# EAGLE design BUS_TEST (EAGLE 9.6.2)
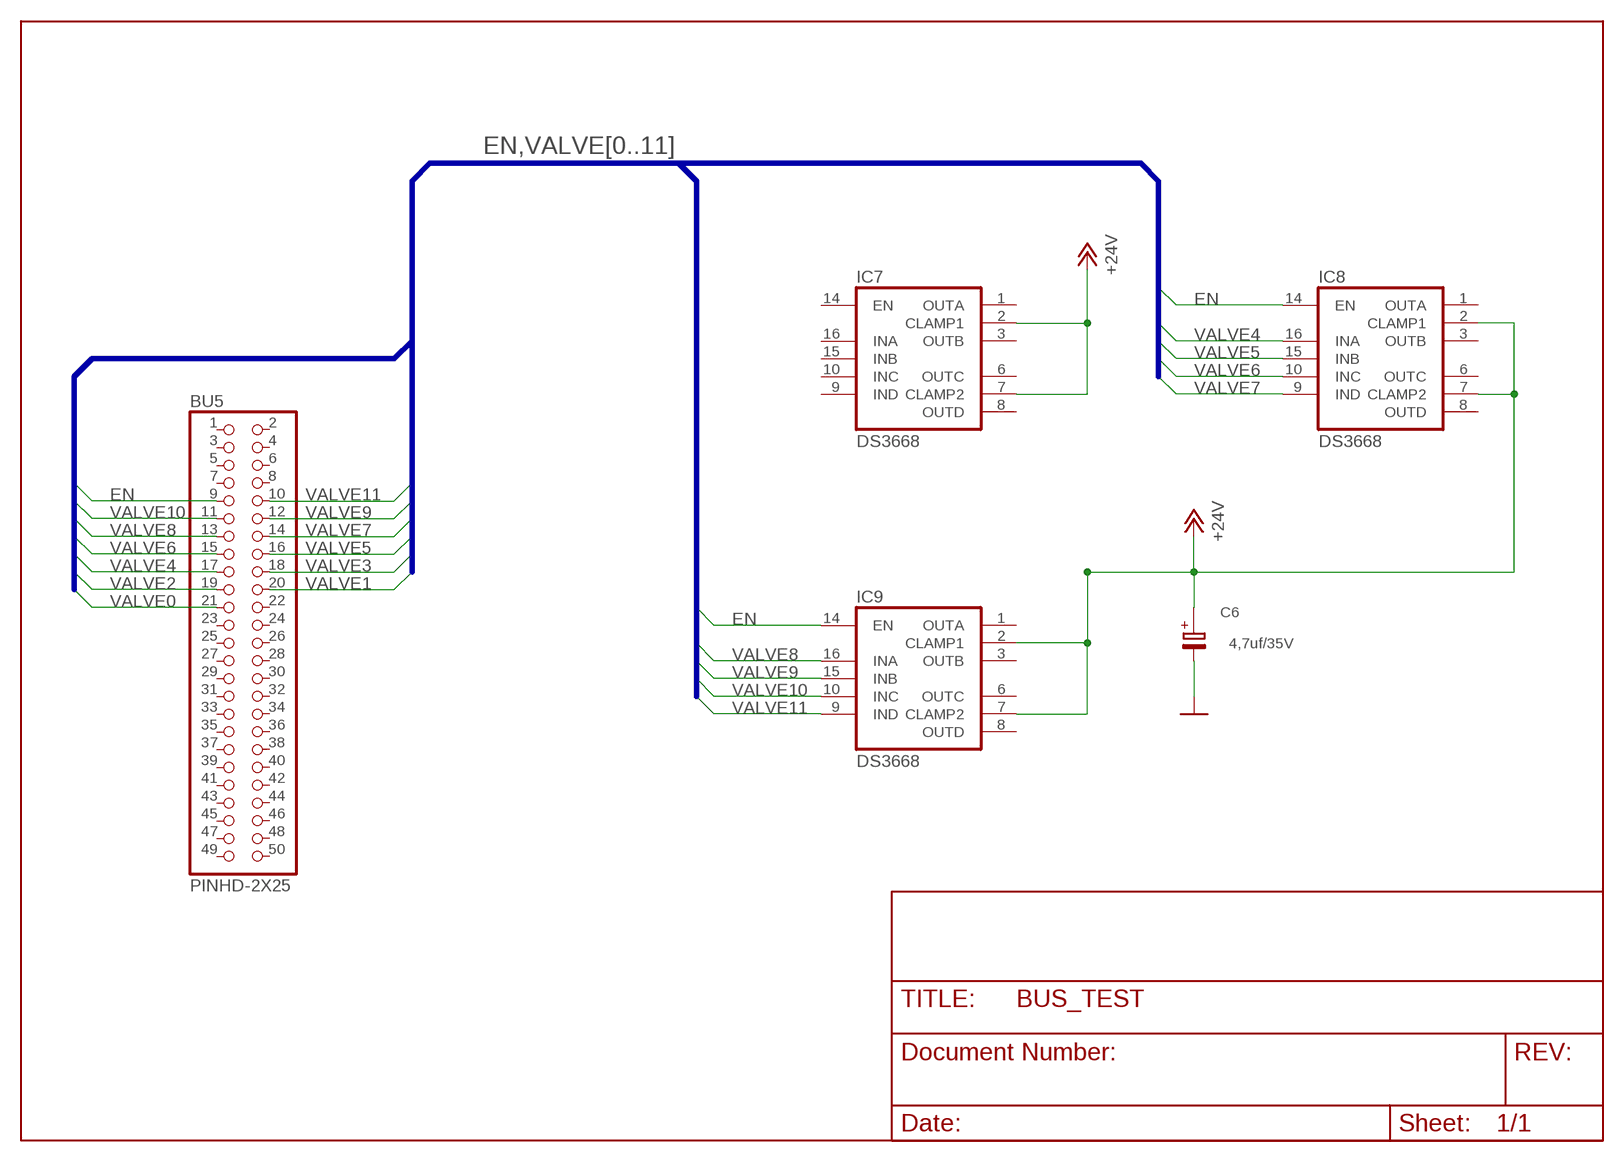
[diagram p0: schematic, sheet 1]

## Parts
BU5  PINHD-2X25  [2X25]
C6  4,7uf/35V  E2-5@1  [E2,5-5]
IC7  DS3668  [DIL-16]
IC8  DS3668  [DIL-16]
IC9  DS3668  [DIL-16]

## Nets
+24V: C6.+ IC7.2(CLAMP1) IC7.7(CLAMP2) IC8.2(CLAMP1) IC8.7(CLAMP2) IC9.2(CLAMP1) IC9.7(CLAMP2)
EN: BU5.9 IC8.14(EN) IC9.14(EN)
GND: C6.-
VALVE0: BU5.21
VALVE1: BU5.20
VALVE2: BU5.19
VALVE3: BU5.18
VALVE4: BU5.17 IC8.16(INA)
VALVE5: BU5.16 IC8.15(INB)
VALVE6: BU5.15 IC8.10(INC)
VALVE7: BU5.14 IC8.9(IND)
VALVE8: BU5.13 IC9.16(INA)
VALVE9: BU5.12 IC9.15(INB)
VALVE10: BU5.11 IC9.10(INC)
VALVE11: BU5.10 IC9.9(IND)
Unconnected: BU5.1 BU5.2 BU5.3 BU5.4 BU5.5 BU5.6 BU5.7 BU5.8 BU5.22 BU5.23 BU5.24 BU5.25 BU5.26 BU5.27 BU5.28 BU5.29 BU5.30 BU5.31 BU5.32 BU5.33 BU5.34 BU5.35 BU5.36 BU5.37 BU5.38 BU5.39 BU5.40 BU5.41 BU5.42 BU5.43 BU5.44 BU5.45 BU5.46 BU5.47 BU5.48 BU5.49 BU5.50 IC7.1(OUTA) IC7.3(OUTB) IC7.6(OUTC) IC7.8(OUTD) IC7.9(IND) IC7.10(INC) IC7.14(EN) IC7.15(INB) IC7.16(INA) IC8.1(OUTA) IC8.3(OUTB) IC8.6(OUTC) IC8.8(OUTD) IC9.1(OUTA) IC9.3(OUTB) IC9.6(OUTC) IC9.8(OUTD)

## Buses
EN,VALVE[0..11]

## Power pins joined to a net without a drawn wire
VCC: IC7.11(VCC) IC8.11(VCC) IC9.11(VCC)
VSS: IC7.4(VSS) IC7.5(VSS) IC7.12(VSS) IC7.13(VSS) IC8.4(VSS) IC8.5(VSS) IC8.12(VSS) IC8.13(VSS) IC9.4(VSS) IC9.5(VSS) IC9.12(VSS) IC9.13(VSS)

## Library data of the parts
BU5 = PINHEAD:PINHD-2X25
C6 = ELKO:E2-5@1
IC7-IC9 = klaus:DS3668

## Board
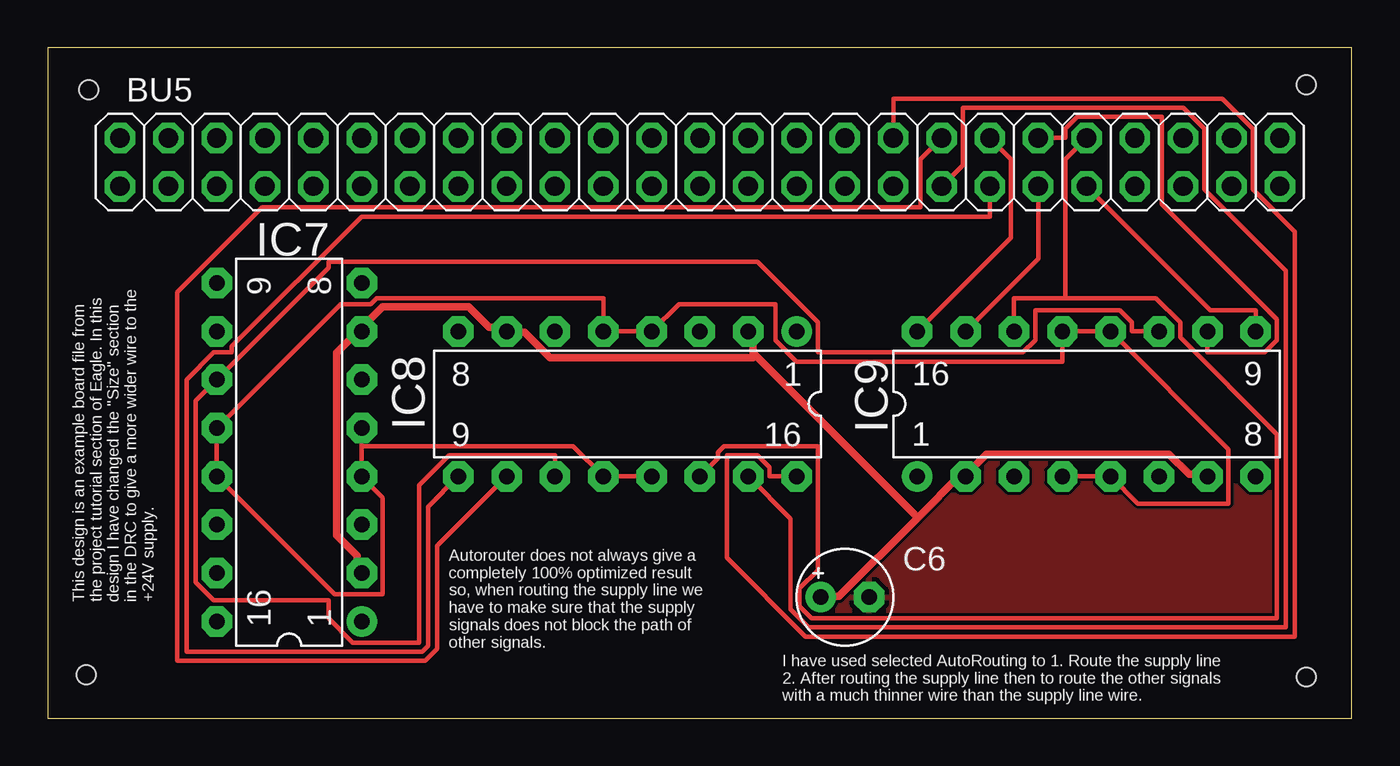
[diagram p1: board, top side]

Size 68.56 x 35.23 mm. Coordinates in mm from the lower left corner, seen from the top.
Outline: 0,0 68.56,0 68.56,35.23 0,35.23 0,0
Copper layers (1*16): Top 0.035mm / dielectric 1.5mm / Bottom 0.035mm
Design rules "default *": minimum track width 9mil, minimum drill 0.45mm, track to track 6mil, track to pad 6mil, pad to pad 6mil, via to via 6mil, smd to smd 6mil, copper to edge 40mil, drill to drill 6mil, minimum pad ring 10mil, minimum via ring 8mil, stop-mask expansion 4mil, vias tented up to drill 0mil, thermal gap 10mil
Holes 1 mm at 2.16,33.02 2.03,2.29 66.17,2.16 66.17,33.27

### Footprints (pad centres in the part's own frame; a part is rotated, then mirrored left to right if it is on the bottom)
2X25 = drill 1.016 pad 1.6 octagon: 1 -30.48,-1.27; 2 -30.48,1.27; 3 -27.94,-1.27; 4 -27.94,1.27; 5 -25.4,-1.27; 6 -25.4,1.27; 7 -22.86,-1.27; 8 -22.86,1.27; 9 -20.32,-1.27; 10 -20.32,1.27; 11 -17.78,-1.27; 12 -17.78,1.27; 13 -15.24,-1.27; 14 -15.24,1.27; 15 -12.7,-1.27; 16 -12.7,1.27; 17 -10.16,-1.27; 18 -10.16,1.27; 19 -7.62,-1.27; 20 -7.62,1.27; 21 -5.08,-1.27; 22 -5.08,1.27; 23 -2.54,-1.27; 24 -2.54,1.27; 25 0,-1.27; 26 0,1.27; 27 2.54,-1.27; 28 2.54,1.27; 29 5.08,-1.27; 30 5.08,1.27; 31 7.62,-1.27; 32 7.62,1.27; 33 10.16,-1.27; 34 10.16,1.27; 35 12.7,-1.27; 36 12.7,1.27; 37 15.24,-1.27; 38 15.24,1.27; 39 17.78,-1.27; 40 17.78,1.27; 41 20.32,-1.27; 42 20.32,1.27; 43 22.86,-1.27; 44 22.86,1.27; 45 25.4,-1.27; 46 25.4,1.27; 47 27.94,-1.27; 48 27.94,1.27; 49 30.48,-1.27; 50 30.48,1.27
E2,5-5 = drill 0.813 pad 1.6: + -1.27,0 | drill 0.813 pad 1.6 octagon: - 1.27,0
DIL-16 = drill 0.813 pad 1.6: 1 -8.89,-3.81 | drill 0.813 pad 1.6 octagon: 2 -6.35,-3.81; 3 -3.81,-3.81; 4 -1.27,-3.81; 5 1.27,-3.81; 6 3.81,-3.81; 7 6.35,-3.81; 8 8.89,-3.81; 9 8.89,3.81; 10 6.35,3.81; 11 3.81,3.81; 12 1.27,3.81; 13 -1.27,3.81; 14 -3.81,3.81; 15 -6.35,3.81; 16 -8.89,3.81

### Placement (x,y rotation side)
BU5  34.29,29.21 180 top
C6  41.91,6.35 0 top
IC7  12.7,13.97 90 top
IC8  30.48,16.51 180 top
IC9  54.61,16.51 0 top

### Tracks (layer width: path | path; a pad name or v marks a point on that pad's centre or on a via)
+24V
  Top 0.381: IC7.2 16.27,7.73 16.27,8.53 15.2,9.6 15.2,19.2 16.27,20.27 IC7.7 16.54,20.54 17.6,21.6 22.14,21.6 23.2,20.54 24,20.54 IC8.7 24.27,20.27 25.07,20.27 26.4,18.94 37.07,18.94 37.2,19.07 | 45.74,10.54 48.01,12.8 IC9.2 48.27,12.8 49.34,13.87 58.94,13.87 60.01,12.8 60.81,12.8 IC9.7 | 45.74,10.54 41.6,6.4 40.8,6.4 C6.+ | 45.74,10.54 37.2,19.07 | 37.2,19.07 37.07,19.2 37.07,20.27 IC8.2
EN
  Top 0.229: IC8.14 35.24,13.65 35.24,13.97 35.56,14.29 40.48,14.29 40.48,7.78 39.53,6.83 39.53,5.87 40.16,5.24 64.61,5.24 64.61,14.92 59.53,20 59.53,20.8 58.26,22.07 53.5,22.07 | 53.5,22.07 50.8,22.07 IC9.14 | BU5.9 53.5,29.37 53.5,22.07
GND
  pour Top: 0,35.56 0,0 68.58,0 68.58,35.56
VALVE4
  Top 0.229: IC8.16 37.94,12.7 37.94,13.18 37.31,13.81 35.72,13.81 35.72,8.41 39.85,4.29 65.56,4.29 65.56,25.56 63.34,27.78 63.34,30.96 61.75,32.54 44.45,32.54 BU5.17
VALVE5
  Top 0.229: IC8.15 39.05,10.48 39.05,5.71 40.01,4.76 65.09,4.76 65.09,23.5 60.8,27.78 60.8,30.96 59.69,32.07 48.1,32.07 48.1,29.05 BU5.16
VALVE6
  Top 0.229: IC8.10 20.48,9.05 20.48,3.65 19.84,3.02 6.83,3.02 6.83,22.38 11.27,26.83 45.88,26.83 45.88,29.37 BU5.15
VALVE7
  Top 0.229: IC8.9 20,11.11 20,3.81 19.68,3.49 7.3,3.49 7.3,17.78 8.73,19.21 9.68,19.21 9.68,19.53 16.51,26.35 49.53,26.35 BU5.14
VALVE8
  Top 0.229: IC9.16 50.64,25.24 50.64,29.37 BU5.13
VALVE9
  Top 0.229: IC9.15 52.07,24.13 BU5.12
VALVE10
  Top 0.229: BU5.11 53.5,30.48 53.5,30.96 54.13,31.59 58.58,31.59 58.58,26.99 64.61,20.95 64.61,19.84 63.98,19.21 60.96,19.21 IC9.10
VALVE11
  Top 0.229: BU5.10 61.12,21.43 63.5,21.43 IC9.9
VCC
  Top 0.229: IC8.11 26.67,13.81 21.11,13.81 19.53,12.22 19.53,3.97 16.03,3.97 14.76,5.24 14.76,6.19 8.73,6.19 7.78,7.14 7.78,16.67 IC7.11 14.76,23.65 14.76,23.97 37.31,23.97 40.48,20.8 40.48,19.21 51.28,19.21 51.91,19.84 51.91,21.43 56.36,21.43 56.99,20.8 56.99,20.32 IC9.11
VSS
  Top 0.229: IC8.13 IC8.12 27.62,14.29 16.51,14.29 | IC7.5 16.51,14.29 | 16.51,14.29 IC7.4 17.62,11.59 17.62,6.51 15.08,6.51 IC7.13 IC7.12 15.4,21.75 16.99,21.75 17.3,22.07 29.21,22.07 IC8.5 IC8.4 33.18,21.75 38.26,21.75 38.26,19.84 39.37,18.73 53.34,18.73 IC9.13 IC9.12 62.07,14.13 62.07,11.27 57.31,11.27 IC9.5 IC9.4

### Text on the board
tNames: This design is an example board file from / the project tutorial section of Eagle. In this / design I have changed the "Size" section / in the DRC to give a more wider wire to the / +24V supply. | Autorouter does not always give a / completely 100% optimized result / so, when routing the supply line we / have to make sure that the supply / signals does not block the path of / other signals. | I have used selected AutoRouting to 1. Route the supply line / 2. After routing the supply line then to route the other signals / with a much thinner wire than the supply line wire.